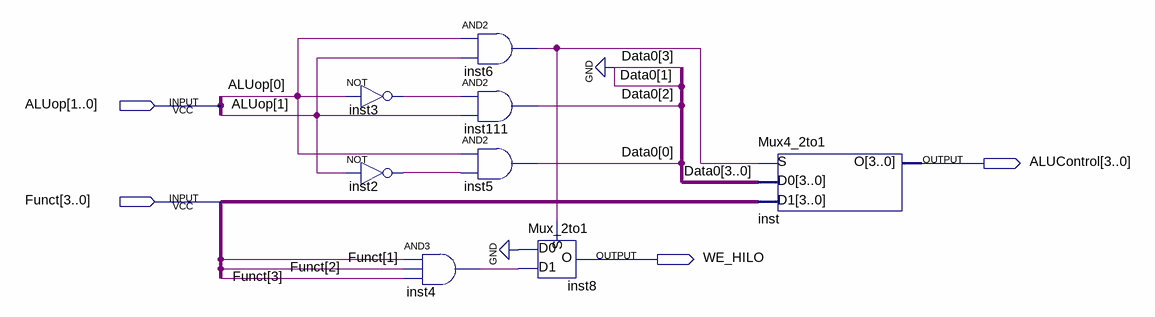
[diagram p0: schematic sheet]
// Quartus schematic ALUControl.bdf as structural Verilog: 8 symbols, 4 pins
module ALUControl (
  input  [1:0] ALUop,
  input  [3:0] Funct,
  output [3:0] ALUControl,
  output WE_HILO
);

  wire inst2_out, inst3_out, inst4_out, inst6_out;
  wire [2:0] Data0;

  not inst3 (inst3_out, ALUop[0]);
  not inst2 (inst2_out, ALUop[1]);
  and inst6 (inst6_out, ALUop[0], ALUop[1]);
  and inst111 (Data0[2], inst3_out, ALUop[1]);
  and inst5 (Data0[0], ALUop[0], inst2_out);
  and inst4 (inst4_out, Funct[1], Funct[2], Funct[3]);
  Mux_2to1 inst8 (.S(inst6_out), .D0(1'b0), .D1(inst4_out), .O(WE_HILO));
  Mux4_2to1 inst (.S(inst6_out), .D0({1'b0, Data0[2], 1'b0, Data0[0]}), .D1(Funct), .O(ALUControl));
endmodule
